# Altium schematic sheet Input.SchDoc
size A4; Organization: Altium Limited; Address1: L3, 12a Rodborough Rd; Address2: Frenchs Forest; Address3: NSW; Address4: Australia 2086
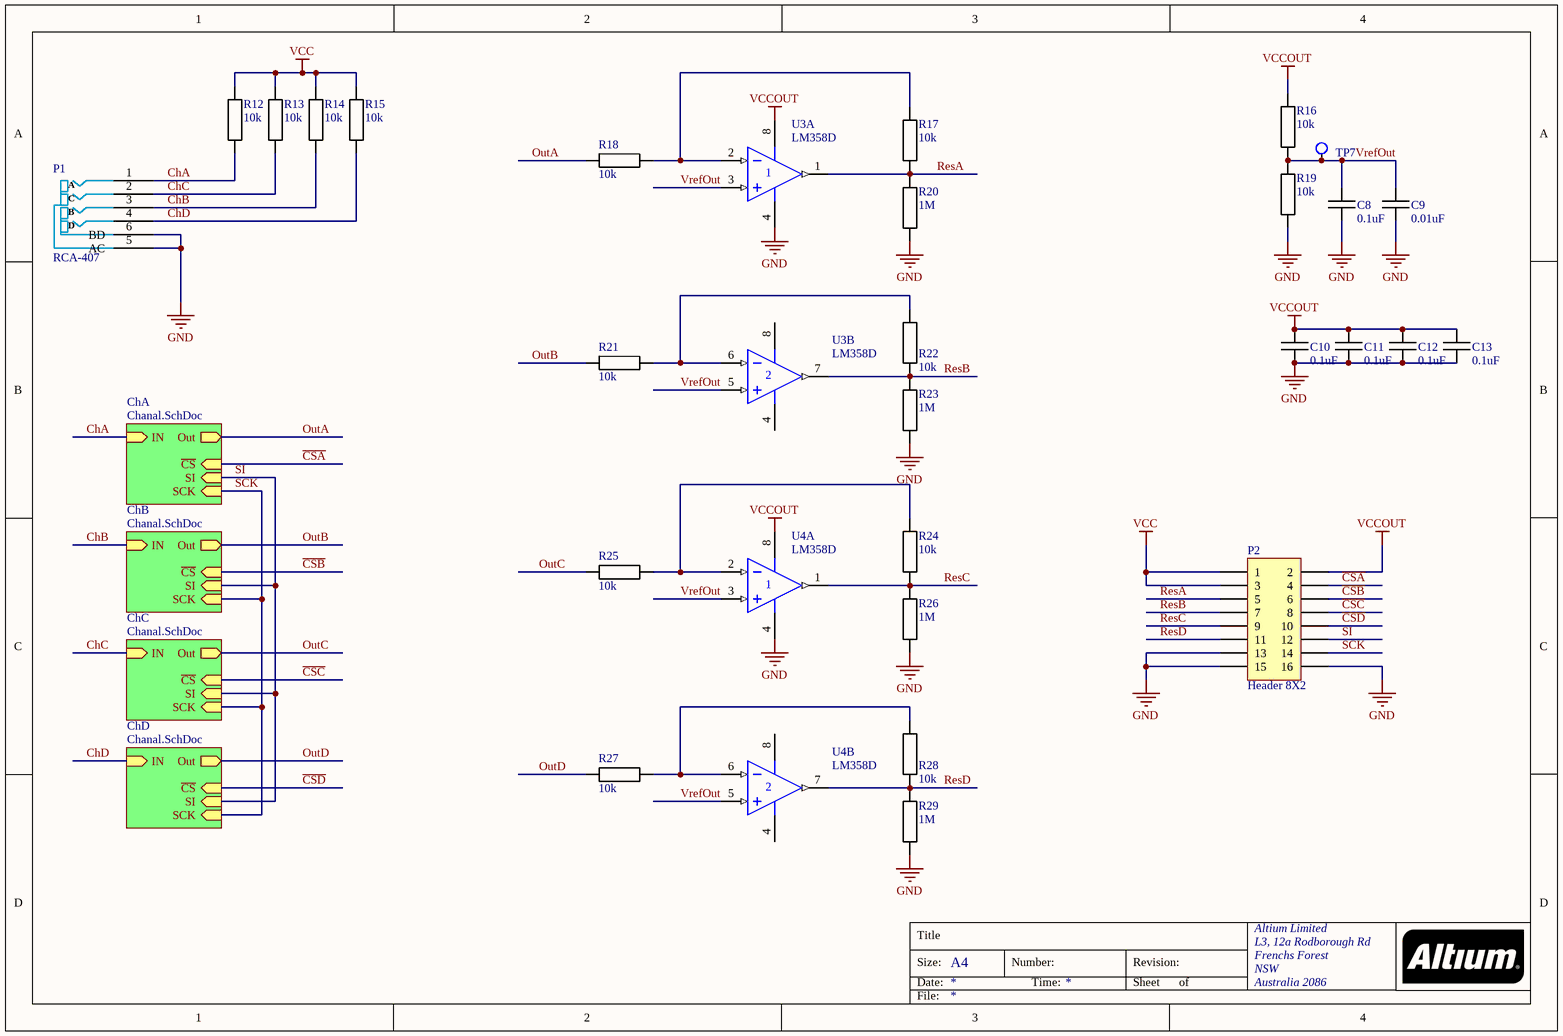
[diagram p0: Input.SchDoc]

## Parts
C8  0.1uF  [SMD 0603]
C9  0.01uF  [SMD 0603]
C10  0.1uF  [SMD 0603]
C11  0.1uF  [SMD 0603]
C12  0.1uF  [SMD 0603]
C13  0.1uF  [SMD 0603]
P1  RCA-407  [RCA4]
P2  Header 8X2  [HDR2X8]
R12  10k  [SMD 0603]
R13  10k  [SMD 0603]
R14  10k  [SMD 0603]
R15  10k  [SMD 0603]
R16  10k  [SMD 0603]
R17  10k  [SMD 0603]
R18  10k  [SMD 0603]
R19  10k  [SMD 0603]
R20  1M  [SMD 0603]
R21  10k  [SMD 0603]
R22  10k  [SMD 0603]
R23  1M  [SMD 0603]
R24  10k  [SMD 0603]
R25  10k  [SMD 0603]
R26  1M  [SMD 0603]
R27  10k  [SMD 0603]
R28  10k  [SMD 0603]
R29  1M  [SMD 0603]
TP7  testPoint  [TESTPOINT]  (value not drawn)
U3  LM358D  [751-02_N]  (parts A,B of 2)
U4  LM358D  [751-02_N]  (parts A,B of 2)

## Sub-sheets
ChA = Chanal.SchDoc: ~{CS} (in), SCK (in), SI (in), IN (in), Out (out)
ChB = Chanal.SchDoc: ~{CS} (in), SCK (in), SI (in), IN (in), Out (out)
ChC = Chanal.SchDoc: ~{CS} (in), SCK (in), SI (in), IN (in), Out (out)
ChD = Chanal.SchDoc: ~{CS} (in), SCK (in), SI (in), IN (in), Out (out)

## Nets
GND: C8.2 C9.2 C10.2 C11.2 C12.2 C13.2 P1.5(AC) P1.6(BD) P2.13 P2.15 P2.16 R19.1 R20.2 R23.2 R26.2 R29.2 U3.4(V-) U4.4(V-)
VCC: P2.1 P2.3 R12.2 R13.2 R14.2 R15.2
VCCOUT: C10.1 C11.1 C12.1 C13.1 P2.2 R16.2 U3.8(V+) U4.8(V+)
~{CSA}: P2.4 ; sheet ChA/~{CS}
~{CSB}: P2.6 ; sheet ChB/~{CS}
~{CSC}: P2.8 ; sheet ChC/~{CS}
~{CSD}: P2.10 ; sheet ChD/~{CS}
ChA: P1.1(A) R12.1 ; sheet ChA/IN
ChB: P1.3(B) R14.1 ; sheet ChB/IN
ChC: P1.2(C) R13.1 ; sheet ChC/IN
ChD: P1.4(D) R15.1 ; sheet ChD/IN
OutA: R18.2 ; sheet ChA/Out
OutB: R21.2 ; sheet ChB/Out
OutC: R25.2 ; sheet ChC/Out
OutD: R27.2 ; sheet ChD/Out
ResA: P2.5 R17.2 R20.1 U3.1(OUT)
ResB: P2.7 R22.2 R23.1 U3.7(OUT)
ResC: P2.9 R24.2 R26.1 U4.1(OUT)
ResD: P2.11 R28.2 R29.1 U4.7(OUT)
SCK: P2.14 ; sheet ChA/SCK, sheet ChB/SCK, sheet ChC/SCK, sheet ChD/SCK
SI: P2.12 ; sheet ChA/SI, sheet ChB/SI, sheet ChC/SI, sheet ChD/SI
VrefOut: C8.1 C9.1 R16.1 R19.2 TP7.0 U3.3(IN+) U3.5(IN+) U4.3(IN+) U4.5(IN+)
NetR17_1: R17.1 R18.1 U3.2(IN-)
NetR21_1: R21.1 R22.1 U3.6(IN-)
NetR24_1: R24.1 R25.1 U4.2(IN-)
NetR27_1: R27.1 R28.1 U4.6(IN-)

## Notes on the sheet
- Title
- Size:
- Date:
- A4
- Number:
- Time:
- Revision:
- Sheet
- of
- File:

## Library data of the parts
C8-C13 = Capasitor
  C8 C10-C13: Value: 0.1uF
  C9: Value: 0.01uF
P1 = RCA-407: RCA 2x2
P2 = Header 8X2: Header, 8-Pin, Dual row; LatestRevisionDate: 17-Jul-2002; LatestRevisionNote: Re-released for DXP Platform.; Publisher: Altium Limited
R12-R29 = Resistor
  R12-R19 R21 R22 R24 R25 R27 R28: Value: 10k
  R20 R23 R26 R29: Value: 1M
U3 U4 = LM358D: Dual Low-Power Operational Amplifier; Published: 17-Jul-2002; LatestRevisionDate: 13-Apr-2006; LatestRevisionNote: IPC-7351 Footprint Added.; DatasheetVersion: 1988; PackageReference: 751-02; Publisher: Altium Limited; PackageDescription: 8-Pin Small Outline Integrated Circuit 1.27 mm Pitch; Code_JEDEC: MS-012-AA; Code_IPC: SOIC127P600-8; ComponentLink1Description: Manufacturer Link; ComponentLink1URL: http://www.onsemi.com/site/products/parametrics/0,4446,251,00.html; ComponentLink2Description: Datasheet; ComponentLink2URL: http://www.onsemi.com/pub/Collateral/LM358-D.PDF